# EAGLE design untitled (EAGLE 9.0.1)
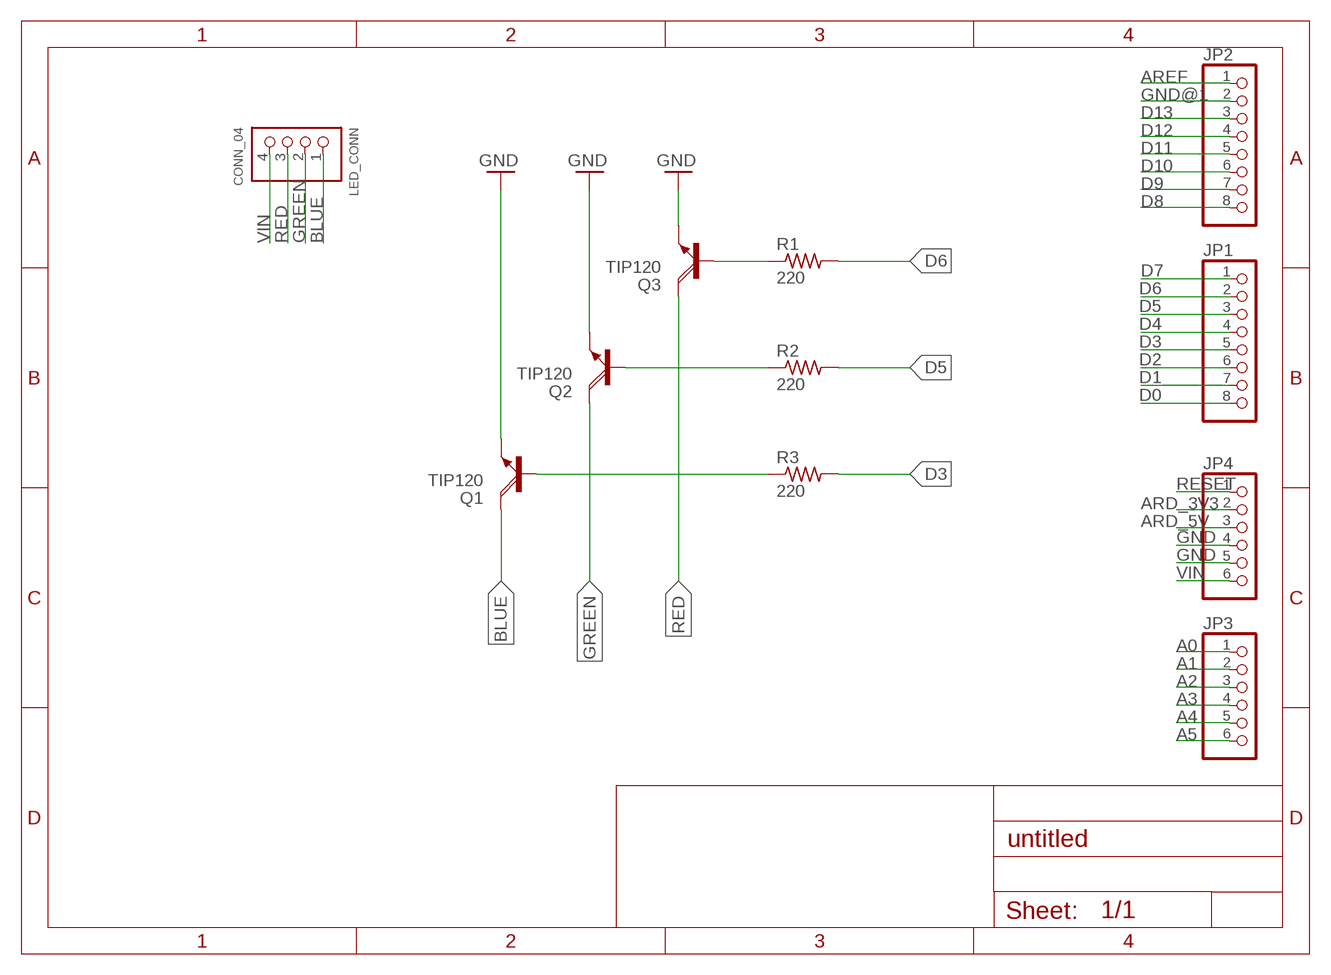
[diagram p0: schematic, sheet 1]

## Parts
JP1  PINHD-1X8  [1X08]
JP2  PINHD-1X8  [1X08]
JP3  PINHD-1X6  [1X06]
JP4  PINHD-1X6  [1X06]
LED_CONN  CONN_04  [SCREWTERMINAL-5MM-4]
Q1  TIP120  [TO220AH]
Q2  TIP120  [TO220AH]
Q3  TIP120  [TO220AH]
R1  220  R-US_0207/10  [0207/10]
R2  220  R-US_0207/10  [0207/10]
R3  220  R-US_0207/10  [0207/10]

## Nets
A0: JP3.1
A1: JP3.2
A2: JP3.3
A3: JP3.4
A4: JP3.5
A5: JP3.6
ARD_3V3: JP4.2
ARD_5V: JP4.3
AREF: JP2.1
BLUE: LED_CONN.1 Q1.C
D0: JP1.8
D1: JP1.7
D2: JP1.6
D3: JP1.5 R3.2
D4: JP1.4
D5: JP1.3 R2.2
D6: JP1.2 R1.2
D7: JP1.1
D8: JP2.8
D9: JP2.7
D10: JP2.6
D11: JP2.5
D12: JP2.4
D13: JP2.3
GND: JP4.4 JP4.5 Q1.E Q2.E Q3.E
GND@1: JP2.2
GREEN: LED_CONN.2 Q2.C
N$7: Q3.B R1.1
N$8: Q2.B R2.1
N$9: Q1.B R3.1
RED: LED_CONN.3 Q3.C
RESET: JP4.1
VIN: JP4.6 LED_CONN.4

## Library data of the parts
JP1 JP2 = pinhead:PINHD-1X8: PIN HEADER
JP3 JP4 = pinhead:PINHD-1X6: PIN HEADER
LED_CONN = Pamir:CONN_04
Q1-Q3 = transistor-power:TIP120: NPN DARLINGTON TRANSISTOR
R1-R3 = adafruit:R-US_: RESISTOR, American symbol

## Board
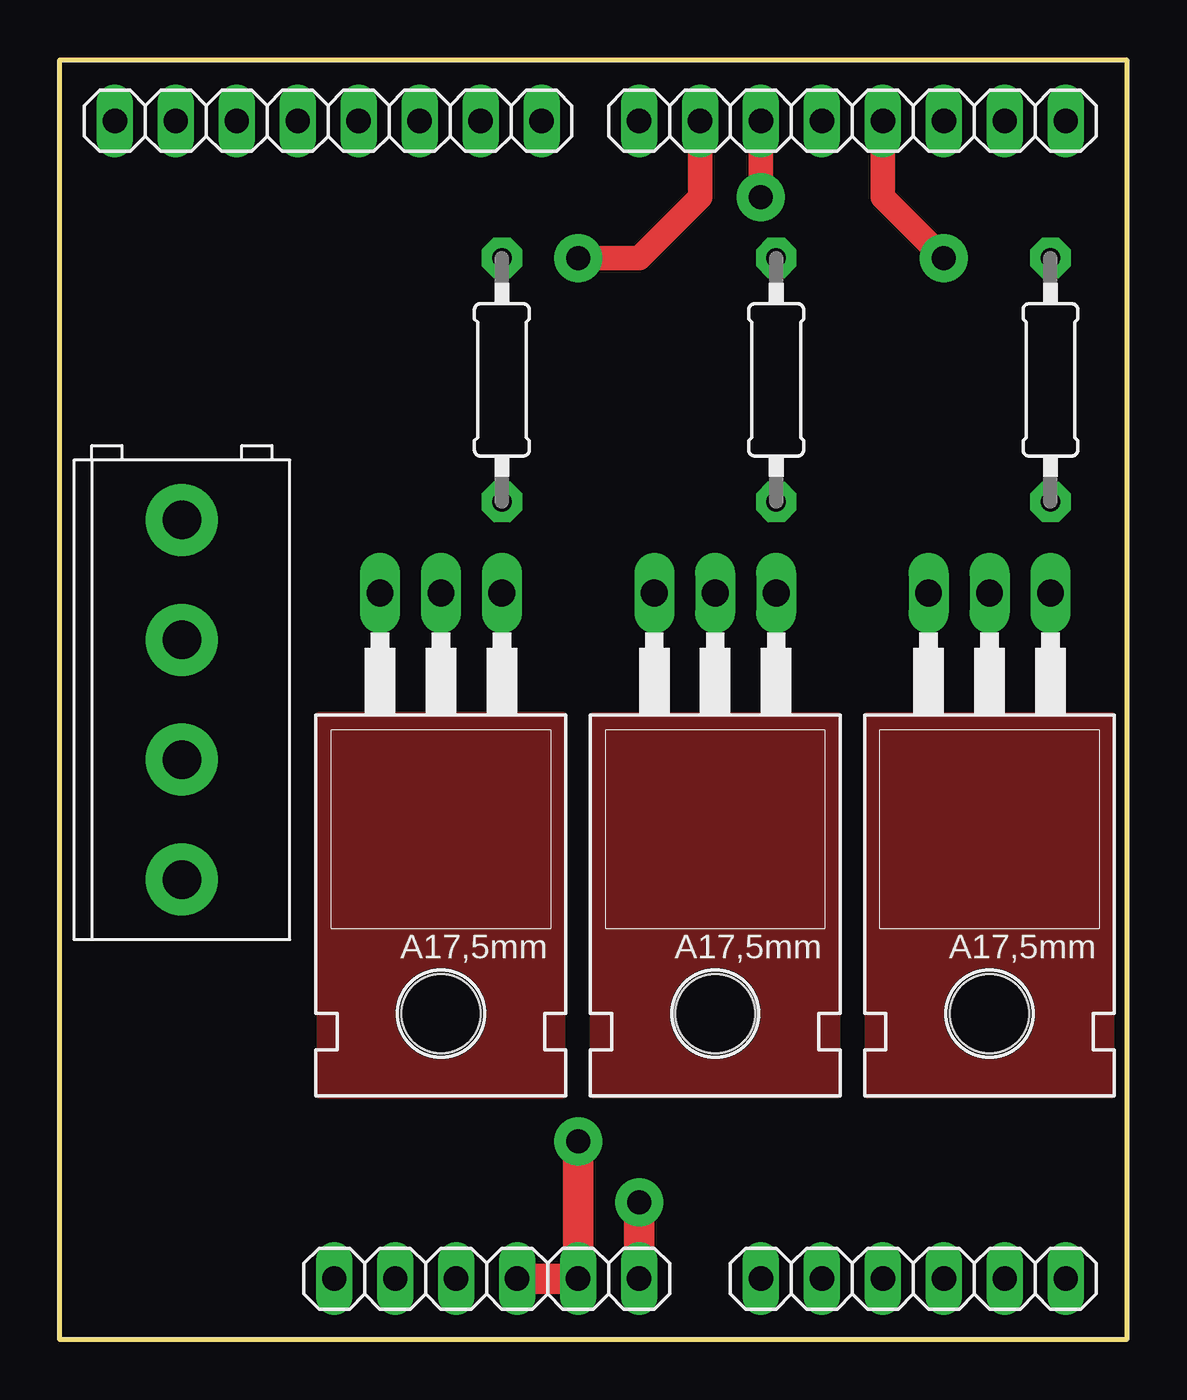
[diagram p1: board, top side]
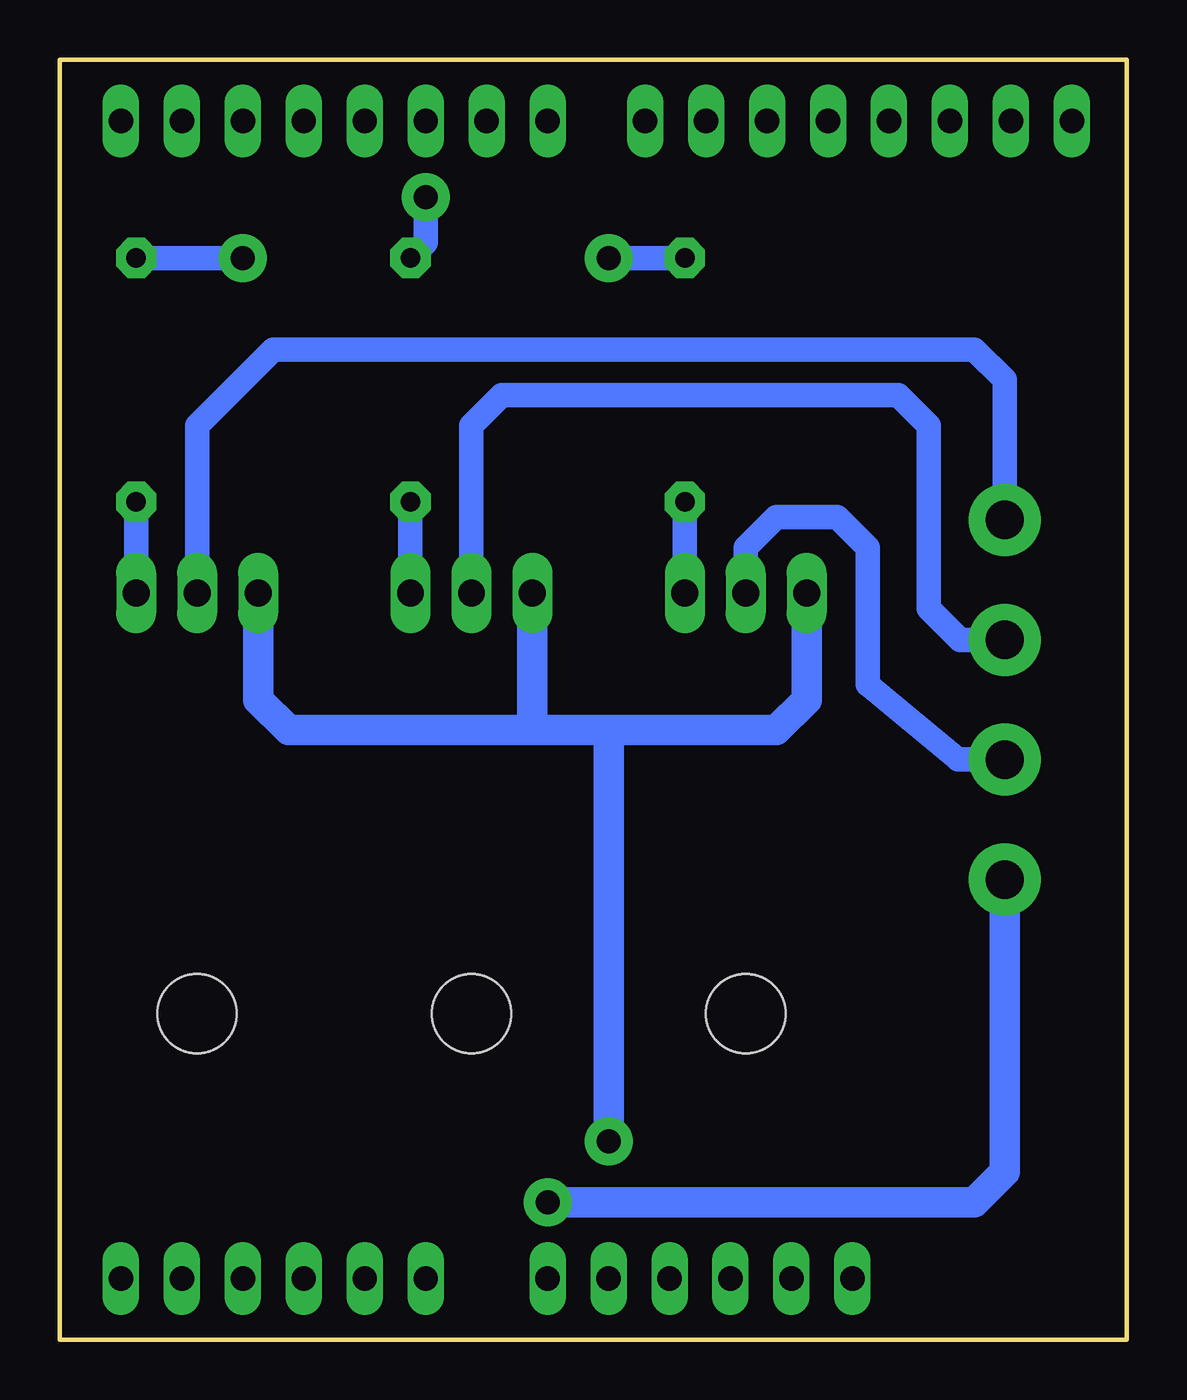
[diagram p2: board, bottom side, seen from below]

Size 44.45 x 53.34 mm. Coordinates in mm from the lower left corner, seen from the top.
Outline: 0,0 0,53.34 44.45,53.34 44.45,0 0,0
Copper layers (1*16): Top 0.035mm / dielectric 1.5mm / Bottom 0.035mm
Design rules "SeeedStudio_2layer_DRU_no_angle_20140221": minimum track width 6mil, minimum drill 12mil, track to track 6mil, track to pad 6mil, pad to pad 6mil, via to via 6mil, smd to smd 0mil, copper to edge 10mil, drill to drill 10mil, minimum pad ring 10mil, minimum via ring 6mil, stop-mask expansion 2mil, vias tented up to drill 100mil, thermal gap 10mil
Milling: 4 lines

### Footprints (pad centres in the part's own frame; a part is rotated, then mirrored left to right if it is on the bottom)
1X08 = drill 1.016 long: 1 -8.89,0; 2 -6.35,0; 3 -3.81,0; 4 -1.27,0; 5 1.27,0; 6 3.81,0; 7 6.35,0; 8 8.89,0
1X06 = drill 1.016 long: 1 -6.35,0; 2 -3.81,0; 3 -1.27,0; 4 1.27,0; 5 3.81,0; 6 6.35,0
SCREWTERMINAL-5MM-4 = drill 1.6 pad 3: 1 -7.5,0; 2 -2.5,0; 3 2.5,0; 4 7.5,0
TO220AH = drill 1.118 long: B -2.54,-6.35; C 0,-6.35; E 2.54,-6.35 | hole 3.302: 0,11.176
0207/10 = drill 0.813 pad 1.676 octagon: 1 -5.08,0; 2 5.08,0

### Placement (x,y rotation side)
JP1  33.02,50.8 0 top
JP2  11.18,50.8 0 top
JP3  35.56,2.54 0 top
JP4  17.78,2.54 0 top
LED_CONN  5.08,26.67 270 top
Q1  38.73,24.77 180 top
Q2  27.3,24.77 180 top
Q3  15.88,24.77 180 top
R1  18.41,40.01 90 top
R2  29.84,40.01 90 top
R3  41.27,40.01 90 top

### Tracks (layer width: path | path; a pad name or v marks a point on that pad's centre or on a via)
BLUE
  Bottom 1.016: Q1.C 38.73,38.1 35.56,41.27 6.35,41.27 5.08,40.01 LED_CONN.1
D3  (via drill 1 pad 2)
  Top 1.016: JP1.5 34.29,47.62 v36.83,45.09
  Bottom 1.016: v36.83,45.09 R3.2
D5  (via drill 1 pad 2)
  Top 1.016: JP1.3 v29.21,47.62
  Bottom 1.016: R2.2 29.21,45.72 v29.21,47.62
D6  (via drill 1 pad 2)
  Top 1.016: JP1.2 26.67,47.62 24.13,45.09 v21.59,45.09
  Bottom 1.016: v21.59,45.09 R1.2
GND  (via drill 1 pad 2)
  Top 1.27: JP4.4 JP4.5 v21.59,8.26
  Bottom 1.27: Q3.E 13.34,26.67 14.61,25.4 21.59,25.4 | 21.59,25.4 24.77,25.4 | 24.77,25.4 34.92,25.4 36.2,26.67 Q1.E | Q2.E 24.77,25.4 | v21.59,8.26 21.59,25.4
GREEN
  Bottom 1.016: Q2.C 27.3,38.1 26.04,39.37 9.53,39.37 8.26,38.1 8.26,30.48 6.95,29.17 LED_CONN.2
N$1
  pour Top: 10.79,26.04 10.79,10.16 20.95,10.16 20.95,26.04
N$2
  pour Top: 22.23,26.04 32.38,26.04 32.38,10.16 22.23,10.16
N$3
  pour Top: 33.66,26.04 43.81,26.04 43.81,10.79 43.81,10.16 33.66,10.16
N$7
  Bottom 1.016: R1.1 Q3.B
N$8
  Bottom 1.016: R2.1 Q2.B
N$9
  Bottom 1.016: R3.1 Q1.B
RED
  Bottom 1.016: LED_CONN.3 7.03,24.17 10.79,27.3 10.79,33.02 12.06,34.29 14.61,34.29 15.88,33.02 Q3.C
VIN  (via drill 1 pad 2)
  Top 1.27: JP4.6 v24.13,5.71
  Bottom 1.27: LED_CONN.4 5.08,6.99 6.35,5.71 v24.13,5.71